# Altium project Amp_Lm386.PrjPcb
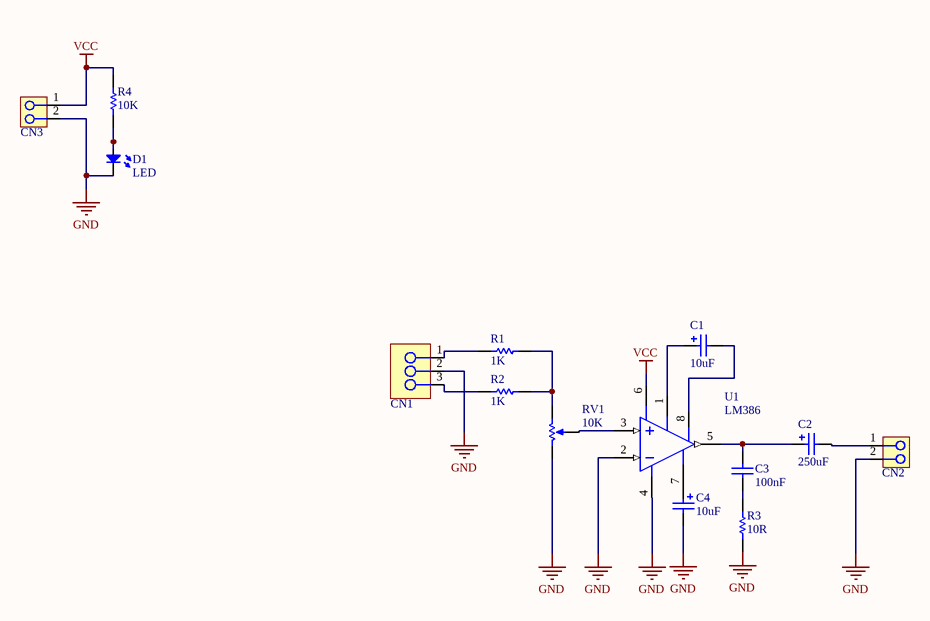
[diagram p0: Amp_Lm386.SchDoc]
1 sheet, 14 parts. Net scope: global (net labels, ports and power ports of the same name join across sheets).
Board file: Amp_Lm386.PcbDoc

## Sheet Amp_Lm386.SchDoc
size A4

### Parts
C1  10uF  [Cap_1]
C2  250uF  [Cap_1]
C3  100nF  [CAP_DISC]
C4  10uF  [Cap_1]
CN1  H3  [H3]  (value not drawn)
CN2  H2  [H2]  (value not drawn)
CN3  H2  [H2]  (value not drawn)
D1  LED  [LED_GREEN]
R1  1K  [Resistor]
R2  1K  [Resistor]
R3  10R  [Resistor]
R4  10K  [Resistor]
RV1  10K  [POT PTH VERTICAL]
U1  LM386  [LM386]

### Nets
GND: C4.2 CN1.2 CN2.2 CN3.2 D1.K R3.1 RV1.3(BOT) U1.2(IN-) U1.4(V-)
VCC: CN3.1 R4.2 U1.6(V+)
NetC1_1: C1.1 U1.1(GAIN)
NetC1_2: C1.2 U1.8(GAIN)
NetC2_1: C2.1 C3.2 U1.5(OUT)
NetC2_2: C2.2 CN2.1
NetC3_1: C3.1 R3.2
NetC4_1: C4.1 U1.7(BYPASS)
NetCN1_1: CN1.1 R1.2
NetCN1_3: CN1.3 R2.2
NetD1_A: D1.A R4.1
NetR1_1: R1.1 R2.1 RV1.1(TOP)
NetRV1_2: RV1.2(TAP) U1.3(IN+)

### Library data of the parts
C1 C4 = Cap_Eletro1: Capacitor Electrolytic; Manufacturer: Nichicon; Manufacturer Part Number: UCA2G100MPD1TD; Voltage Rating: 400V; Tolerance: 20%; Ripple Current: 280mA; Life (Hours): 10000Hour; Lead Diameter: 0.6mm; Supplier 1: Digi-Key; Stock 1: 9403; Pricing 1: 1=0.78, 10=0.573, 100=0.3927 (USD); Mount: Through Hole; Case/Package: Radial; Min Operating Temperature: -25°C; Max Operating Temperature: 105°C; Package Quantity: 500; Capacitance: 10uF; Packaging: Tape and Reel; Termination: Radial; Voltage Rating (DC): 400V; Lead Pitch: 0.197inch; Height - Seated (Max): 0.846inch; Lead Free: Lead Free; ComponentLink1URL: https://datasheet.ciiva.com/6299/e-ca-6299384.pdf; ComponentLink1Description: https://datasheet.ciiva.com/6299/e-ca-6299384.pdf; Supplier Part Number 1: 493-4771-1-ND
C2 = Cap_Eletro1: Capacitor Electrolytic; Manufacturer: Nichicon; Manufacturer Part Number: UCA2G100MPD1TD; Capacitance: 10uF; Voltage Rating: 400V; Tolerance: 20%; Ripple Current: 280mA; Life (Hours): 10000Hour; Lead Diameter: 0.6mm; Supplier 1: Digi-Key; Stock 1: 9403; Pricing 1: 1=0.78, 10=0.573, 100=0.3927 (USD); Mount: Through Hole; Case/Package: Radial; Min Operating Temperature: -25°C; Max Operating Temperature: 105°C; Package Quantity: 500; Packaging: Tape and Reel; Termination: Radial; Voltage Rating (DC): 400V; Lead Pitch: 0.197inch; Height - Seated (Max): 0.846inch; Lead Free: Lead Free; ComponentLink1URL: https://datasheet.ciiva.com/6299/e-ca-6299384.pdf; ComponentLink1Description: https://datasheet.ciiva.com/6299/e-ca-6299384.pdf; Supplier Part Number 1: 493-4771-1-ND
C3 = Capacitor_Cerâmica: Capacitor Disc Ceramic; Manufacturer: Multicomp; Manufacturer Part Number: MCCC100V104KY5P; Tolerance: 10%; Voltage Rating: 100V; Dielectric: Y5P; Supplier 1: Farnell; Stock 1: 2845; Pricing 1: 1=0.751, 10=0.343, 100=0.285, 500=0.2, 1000=0.172, 5000=0.15, 10000=0.134 (GBP); Case/Package: Radial; Number of Pins: 2; Min Operating Temperature: -30°C; Max Operating Temperature: 85°C; Capacitance: 100nF; Voltage Rating (DC): 100V; REACH SVHC: Unknown; ComponentLink1URL: http://www.farnell.com/datasheets/1523828.pdf; ComponentLink1Description: http://www.farnell.com/datasheets/1523828.pdf; Supplier Part Number 1: 1600815
CN1 = H3: KRE2/WD-128 3T; Manufacturer: On-Shore Technology; Manufacturer Part Number: OSTTA034163; Plating: Steel,Zinc; Max Current Rating: 15A; Number of Levels: 1; Number of Positions Per Level: 3; Voltage: 300V; Wire Gauge (Max): 22AWG; Wire Gauge (Min): 14AWG; Pitch: 0.2inch; Supplier 1: Digi-Key; Stock 1: 12938; Pricing 1: 1=1.08, 10=0.674, 25=0.5768, 50=0.5184, 100=0.5076, 250=0.432, 500=0.4104, 1000=0.3672, 5000=0.2873 (USD); Mount: Through Hole; Contact Plating: Tin,Zinc; Contact Material: Brass,Steel; Colour: Blue; Housing Colour: Blue; Housing Material: Thermoplastic; Min Operating Temperature: -30°C; Max Operating Temperature: 105°C; Number of Rows: 1; Packaging: Bulk; Current: 15A; Termination: Screw; Number of Contacts: 3; Max Voltage Rating (AC): 300V; Orientation: Straight; Number of Positions: 3; Length: 15.94mm; Height: 13mm; Depth: 9mm; Width: 9mm; Lead Free: Contains Lead; Flammability Rating: UL94 V-0; ComponentLink1URL: https://datasheet.ciiva.com/19454/152355-19454564.pdf; ComponentLink1Description: https://datasheet.ciiva.com/19454/152355-19454564.pdf; ComponentLink2URL: https://datasheet.ciiva.com/823/osttaxx4163-823578.pdf; ComponentLink2Description: https://datasheet.ciiva.com/823/osttaxx4163-823578.pdf; Supplier Part Number 1: ED2581-ND
CN2 CN3 = H2: KRE2/WD-128 2T; Manufacturer: On-Shore Technology; Manufacturer Part Number: OSTTA024163; Plating: Steel,Zinc; Max Current Rating: 15A; Number of Levels: 1; Number of Positions Per Level: 2; Voltage: 300V; Wire Gauge (Max): 22AWG; Wire Gauge (Min): 14AWG; Pitch: 0.2inch; Supplier 1: Digi-Key; Stock 1: 26493; Pricing 1: 1=0.73, 10=0.452, 25=0.3872, 50=0.348, 100=0.3408, 250=0.29, 500=0.2755, 1000=0.2465, 5000=0.1929 (USD); Mount: Through Hole; Contact Plating: Tin,Zinc; Contact Material: Brass,Steel; Colour: Blue; Housing Colour: Blue; Housing Material: Thermoplastic; Min Operating Temperature: -30°C; Max Operating Temperature: 105°C; Number of Rows: 1; Packaging: Bulk; Current: 15A; Termination: Screw; Number of Contacts: 2; Max Voltage Rating (AC): 300V; Orientation: Straight; Number of Positions: 2; Length: 10.86mm; Height: 13mm; Depth: 9mm; Width: 9mm; Lead Free: Lead Free; Flammability Rating: UL94 V-0; ComponentLink1URL: https://datasheet.ciiva.com/19454/152347-19454562.pdf; ComponentLink1Description: https://datasheet.ciiva.com/19454/152347-19454562.pdf; ComponentLink2URL: https://datasheet.ciiva.com/823/osttaxx4163-823567.pdf; ComponentLink2Description: https://datasheet.ciiva.com/823/osttaxx4163-823567.pdf; Supplier Part Number 1: ED2580-ND
D1 = LED-GREEN: Light Emissor Diode - 5mm; Manufacturer: Kingbright; Manufacturer Part Number: WP7113LGD; Colour: Green; Lens Style: Round,Diffused,Tinted; Luminous Intensity: 2mcd; Viewing Angle: 30°; Forward Voltage: 1.9V; Forward Current: 25mA; Dominant Wavelength: 568nm; Test Current: 2mA; Supplier 1: Digi-Key; Stock 1: 193634; Pricing 1: 1=0.48, 10=0.342, 25=0.2624, 100=0.171, 250=0.1254, 500=0.1064, 1000=0.0874, 2500=0.076, 5000=0.0684 (USD); Mount: Through Hole; Case/Package: Radial; Lens Colour: Green; Min Operating Temperature: -40°C; Max Operating Temperature: 85°C; Illumination Colour: Green; Packaging: Bulk; Package Quantity: 1000; Height: 8.6mm; Lead Free: Lead Free; ComponentLink1URL: https://datasheet.ciiva.com/16510/wp7113lgd-16510240.pdf; ComponentLink1Description: https://datasheet.ciiva.com/16510/wp7113lgd-16510240.pdf; ComponentLink2URL: https://datasheet.ciiva.com/4692/wp7113lgd-83708-4692822.pdf; ComponentLink2Description: https://datasheet.ciiva.com/4692/wp7113lgd-83708-4692822.pdf; ComponentLink3URL: https://datasheet.ciiva.com/14604/70062982-14604412.pdf; ComponentLink3Description: https://datasheet.ciiva.com/14604/70062982-14604412.pdf; ComponentLink4URL: https://datasheet.ciiva.com/2114/wp7113lgd-2114397.pdf; ComponentLink4Description: https://datasheet.ciiva.com/2114/wp7113lgd-2114397.pdf; Supplier Part Number 1: 754-1265-ND
R1-R4 = Resistor: Carbon Fiber 1/4W; Manufacturer: Stackpole Electronics; Manufacturer Part Number: CF14JT10K0; Resistance: 10kR; Tolerance: 5%; Power Rating: 250mW; Temperature Coefficient: -500ppm/°C; Supplier 1: Digi-Key; Stock 1: 864013; Pricing 1: 1=0.1, 10=0.04, 25=0.0288, 50=0.022, 100=0.0162, 250=0.0124, 500=0.0099, 1000=0.0073 (USD); Mount: Through Hole,Axial; Case/Package: Conformal; Contact Plating: Tin,Matte; Min Operating Temperature: -55°C; Max Operating Temperature: 155°C; Packaging: Tape and Reel; Package Quantity: 1; Composition: Carbon Film; Number of Terminations: 2; Military Standard: Not; Termination: Axial; Max Power Dissipation: 250mW; Diameter: 2.3mm; Length: 6.5mm; Radiation Hardening: No; Lead Free: Lead Free; ComponentLink1URL: https://www.verical.com/server-webapp/html/getDatasheet?partID=367360; ComponentLink1Description: https://www.verical.com/server-webapp/html/getDatasheet?partID=367360; ComponentLink2URL: https://www.seielect.com/catalog/SEI-CF_CFM.pdf; ComponentLink2Description: https://www.seielect.com/catalog/SEI-CF_CFM.pdf; ComponentLink3URL: http://www.seielect.com/Catalog/SEI-CF_CFM.pdf; ComponentLink3Description: http://www.seielect.com/Catalog/SEI-CF_CFM.pdf; ComponentLink4URL: http://components.arrow.com/part/dataview/27619991S9848636N1174; ComponentLink4Description: http://components.arrow.com/part/dataview/27619991S9848636N1174; Supplier Part Number 1: CF14JT10K0CT-ND
RV1 = Potentiometer PTH Verticacl
U1 = LM386: Amp mono